# EAGLE design remote-displayV2 (EAGLE 9.6.2)
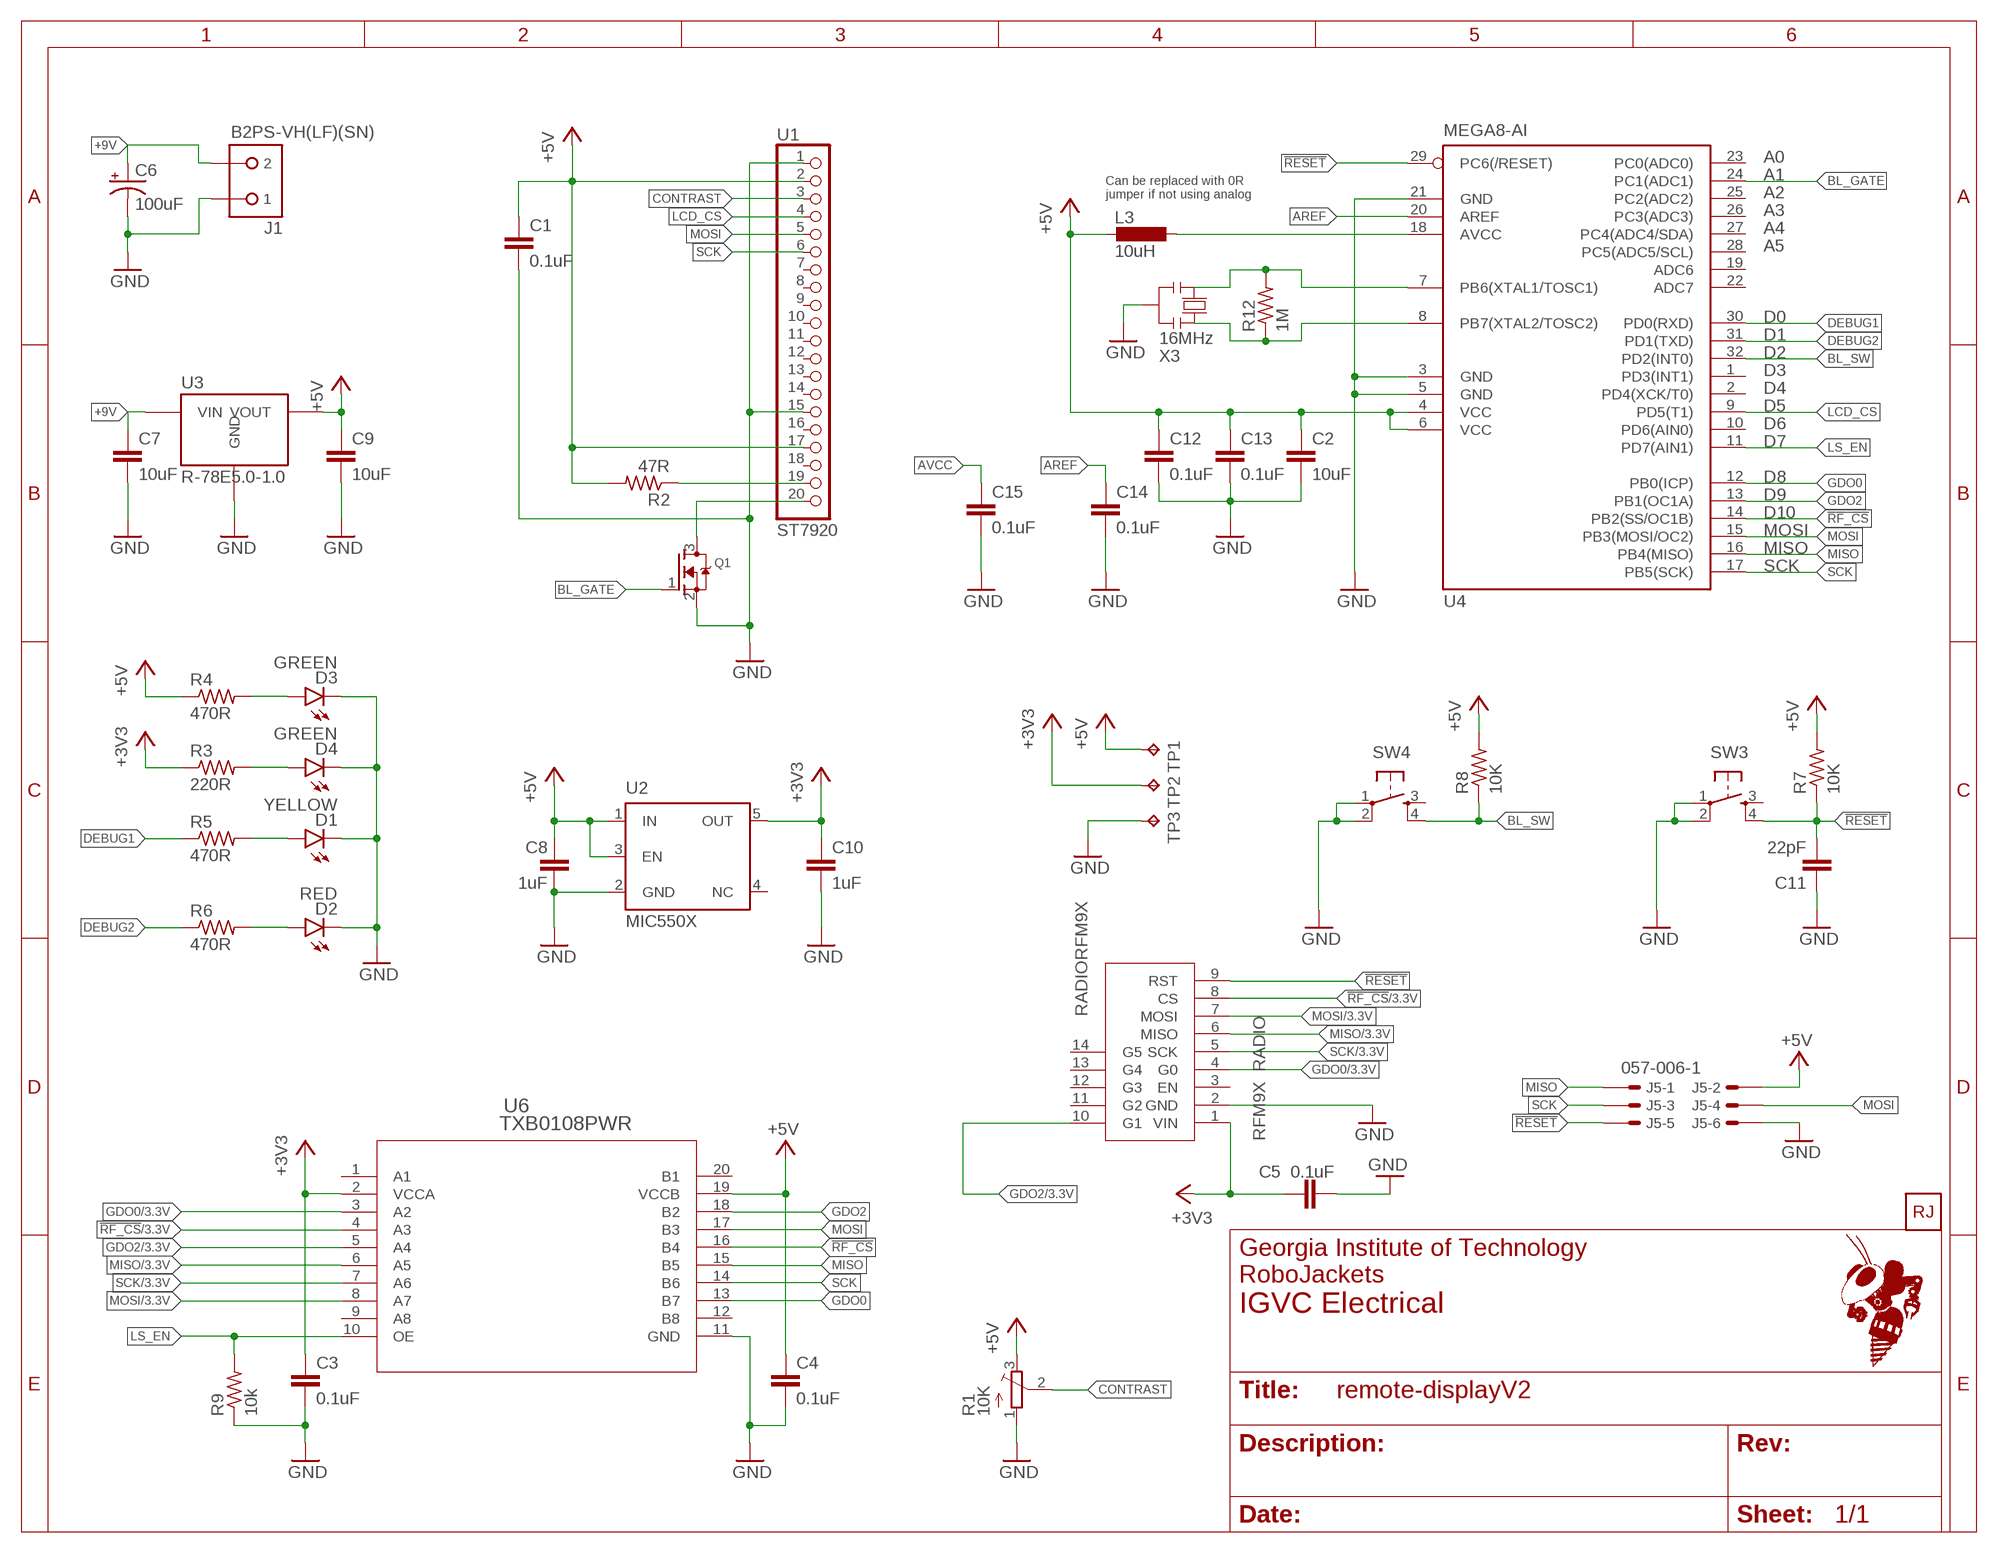
[diagram p0: schematic, sheet 1]
FRAME1 (FRAME_A_L): TEAM: IGVC Electrical

## Parts
C1  0.1uF  C-EUC0603  [C0603]
C2  10uF  C-EUC0805  [C0805]
C3  0.1uF  C-EUC0603  [C0603]
C4  0.1uF  C-EUC0603  [C0603]
C5  0.1uF  C-EUC0603  [C0603]
C6  100uF  CPOL-USE5-10.5  [E5-10,5]
C7  10uF  C-EUC0603  [C0603]
C8  1uF  C-EUC0603  [C0603]
C9  10uF  C-EUC0603  [C0603]
C10  1uF  C-EUC0603  [C0603]
C11  22pF  C-EUC0603  [C0603]
C12  0.1uF  C-EUC0603  [C0603]
C13  0.1uF  C-EUC0603  [C0603]
C14  0.1uF  C-EUC0603  [C0603]
C15  0.1uF  C-EUC0603  [C0603]
D1  YELLOW  LED3MM  [LED3MM]
D2  RED  LED3MM  [LED3MM]
D3  GREEN  LED3MM  [LED3MM]
D4  GREEN  LED3MM  [LED3MM]
J1  B2PS-VH(LF)(SN)  [B2PS-CENTERED]
J5  057-006-1  [057-006-1]
L3  10uH  L-0805  [0805]
Q1  MOSFET-NREFLOW  [SOT23]
R1  10K  TRIMPOT3386  [TRIM-3386]
R2  47R  R-US_R0805  [R0805]
R3  220R  R-US_R0603  [R0603]
R4  470R  R-US_R0603  [R0603]
R5  470R  R-US_R0603  [R0603]
R6  470R  R-US_R0603  [R0603]
R7  10K  R-US_R0603  [R0603]
R8  10K  R-US_R0603  [R0603]
R9  10k  R-US_R0603  [R0603]
R12  1M  R-US_R0603  [R0603]
SW3  TL1105_A-H  [TL1105_A-H]
SW4  TL1105_A-H  [TL1105_A-H]
TP1  TPPAD1-17  [P1-17]
TP2  TPPAD1-17  [P1-17]
TP3  TPPAD1-17  [P1-17]
U1  ST7920  [ST7920-LCD]
U2  MIC550X  [SOT23-DBV]
U3  R-78E5.0-1.0  [R-78E]
U4  MEGA8-AI  [TQFP32-08]
U6  TXB0108PWR  [PW20]
U$1  RADIORFM9X  [RFM9X]
U$2  ROBOBUZZ1.0X  [ROBOBUZZ_1.0X]
X3  16MHz  OSC_CSTCE16M0V53-R0  [RESONATOR]

## Nets
!RESET: C11.2 J5.5 R7.1 SW3.4 U4.29(PC6(/RESET)) U$1.9(RST)
!RF_CS!: U4.14(PB2(SS/OC1B)) U6.16(B4)
!RF_CS!/3.3V: U6.4(A3) U$1.8(CS)
+3V3: C3.1 C5.1 C10.1 R3.1 TP2.TP U2.5(OUT) U6.2(VCCA) U$1.1(VIN)
+5V [power]: C1.1 C2.1 C4.1 C8.1 C9.1 C12.1 C13.1 J5.2 L3.2 R1.3(E) R2.2 R4.1 R7.2 R8.2 TP1.TP U1.2 U1.17 U2.1(IN) U2.3(EN) U3.3(VOUT) U4.4(VCC) U4.6(VCC) U6.19(VCCB)
+9V [power]: C6.+ C7.1 J1.2 U3.1(VIN)
AREF: C14.1 U4.20(AREF)
AVCC: C15.1 L3.1 U4.18(AVCC)
BL_DRAIN: Q1.3(D) U1.20
BL_GATE: Q1.1(G) U4.24(PC1(ADC1))
BL_SW: R8.1 SW4.4 U4.32(PD2(INT0))
CONTRAST: R1.2(S) U1.3
DEBUG1: R5.1 U4.30(PD0(RXD))
DEBUG2: R6.1 U4.31(PD1(TXD))
GDO0: U4.12(PB0(ICP)) U6.13(B7)
GDO0/3.3V: U6.3(A2) U$1.4(G0)
GDO2: U4.13(PB1(OC1A)) U6.18(B2)
GDO2/3.3V: U6.5(A4) U$1.10(G1)
GND [power]: C1.2 C2.2 C3.2 C4.2 C5.2 C6.- C7.2 C8.2 C9.2 C10.2 C11.1 C12.2 C13.2 C14.2 C15.2 D1.K(C) D2.K(C) D3.K(C) D4.K(C) J1.1 J5.6 Q1.2(S) R1.1(A) R9.1 SW3.1 SW3.2 SW4.1 SW4.2 TP3.TP U1.1 U1.15 U2.2(GND) U3.2(GND) U4.3(GND) U4.5(GND) U4.21(GND) U6.11(GND) U$1.2(GND) X3.2
LCD_BL: R2.1 U1.19
LCD_CS: U1.4 U4.9(PD5(T1))
LS_EN: R9.2 U4.11(PD7(AIN1)) U6.10(OE)
MISO: J5.1 U4.16(PB4(MISO)) U6.15(B5)
MISO/3.3V: U6.6(A5) U$1.6(MISO)
MOSI: J5.4 U1.5 U4.15(PB3(MOSI/OC2)) U6.17(B3)
MOSI/3.3V: U6.8(A7) U$1.7(MOSI)
PWR_LED: D3.A R4.2
PWR_LED1: D4.A R3.2
SCK: J5.3 U1.6 U4.17(PB5(SCK)) U6.14(B6)
SCK/3.3V: U6.7(A6) U$1.5(SCK)
STAT1_LED: D1.A R5.2
STAT2_LED: D2.A R6.2
XTAL1: R12.2 U4.7(PB6(XTAL1/TOSC1)) X3.1
XTAL2: R12.1 U4.8(PB7(XTAL2/TOSC2)) X3.3
Unconnected: SW3.3 SW4.3 U1.7 U1.8 U1.9 U1.10 U1.11 U1.12 U1.13 U1.14 U1.16 U1.18 U2.4(NC) U4.1(PD3(INT1)) U4.2(PD4(XCK/T0)) U4.10(PD6(AIN0)) U4.19(ADC6) U4.22(ADC7) U4.23(PC0(ADC0)) U4.25(PC2(ADC2)) U4.26(PC3(ADC3)) U4.27(PC4(ADC4/SDA)) U4.28(PC5(ADC5/SCL)) U6.1(A1) U6.9(A8) U6.12(B8) U6.20(B1) U$1.3(EN) U$1.11(G2) U$1.12(G3) U$1.13(G4) U$1.14(G5)

## Notes on the sheet
- A0
- A1
- Can be replaced with 0R
  jumper if not using analog
- A2
- A3
- A4
- A5
- D0
- D1
- D2
- D3
- D4
- D5
- D6
- D7
- D8
- D9
- D10

## Library data of the parts
C1 C2 C5 C11-C15 = resistor:C-EU: CAPACITOR, European symbol
C3 C4 C7-C10 = rcl:C-EU: CAPACITOR, European symbol; SPICEPREFIX: C
C6 = rcl:CPOL-US: POLARIZED CAPACITOR, American symbol; SPICEPREFIX: C
D1-D4 = led:LED: LED OSRAM: - CHIPLED LG R971, LG N971, LY N971, LG Q971, LY Q971, LO R971, LY R971 LH N974, LH R974 LS Q976, LO Q976, LY Q976 LO Q996 - Hyper CHIPLED LW Q18S LB Q993, LB Q99A, LB R99A - SideLED LS A670, LO A670, LY A670, LG A670, LP A670 LB A673, LV A673, LT A673, LW A673 LH A674 LY A675 LS A676, LA A676, LO A676, LY A676, LW A676 LS A679, LY A679, LG A679 - Hyper Micro SIDELED® LS Y876, LA Y876, LO Y876, LY Y876 LT Y87S - SmartLED LW L88C, LW L88S LB L89C, LB L89S, LG L890 LS L89K, LO L89K, LY L89K LS L896, LA L896, LO L896, LY L896 - TOPLED LS T670, LO T670, LY T670, LG T670, LP T670 LSG T670, LSP T670, LSY T670, LOP T670, LYG T670 LG T671, LOG T671, LSG T671 LB T673, LV T673, LT T673, LW T673 LH T674 LS T676, LA T676, LO T676, LY T676, LB T676, LH T676, LSB T676, LW T676 LB T67C, LV T67C, LT T67C, LS T67K, LO T67K, LY T67K, LW E67C LS E67B, LA E67B, LO E67B, LY E67B, LB E67C, LV E67C, LT E67C LW T67C LS T679, LY T679, LG T679 LS T770, LO T770, LY T770, LG T770, LP T770 LB T773, LV T773, LT T773, LW T773 LH T774 LS E675, LA E675, LY E675, LS T675 LS T776, LA T776, LO T776, LY T776, LB T776 LHGB T686 LT T68C, LB T68C - Hyper Mini TOPLED® LB M676 - Mini TOPLED Santana® LG M470 LS M47K, LO M47K, LY M47K Source: http://www.osram.convergy.de LUXEON: - LUMILED® LXK2-PW12-R00, LXK2-PW12-S00, LXK2-PW14-U00, LXK2-PW14-V00 LXK2-PM12-R00, LXK2-PM12-S00, LXK2-PM14-U00 LXK2-PE12-Q00, LXK2-PE12-R00, LXK2-PE12-S00, LXK2-PE14-T00, LXK2-PE14-U00 LXK2-PB12-K00, LXK2-PB12-L00, LXK2-PB12-M00, LXK2-PB14-N00, LXK2-PB14-P00, LXK2-PB14-Q00 LXK2-PR12-L00, LXK2-PR12-M00, LXK2-PR14-Q00, LXK2-PR14-R00 LXK2-PD12-Q00, LXK2-PD12-R00, LXK2-PD12-S00 LXK2-PH12-R00, LXK2-PH12-S00 LXK2-PL12-P00, LXK2-PL12-Q00, LXK2-PL12-R00 Source: www.luxeon.com KINGBRIGHT: KA-3528ASYC Source: www.kingbright.com
J1 = RoboJackets-Connectors:B2P?-VH(LF)(SN): Power Connector Brand: JST Sales America Inc. <https://www.jst.com/> Series: VH <http://www.digikey.com/product-search/en?FV=fff40016,fff802f3,ffec0e9d> Distributor: Digi-Key <http://www.digikey.com/product-detail/en/B2PS-VH%28LF%29%28SN%29/455-1648-ND/926555>; DIGIKEY: 455-1648-ND; MPN: B2PS-VH(LF)(SN)
J5 = con-panduit:057-006-: CONNECTOR 6-pin series 057 contact pc board low profile headers; DIGIKEY: 3M15451-ND; OC_FARNELL: unknown; OC_NEWARK: unknown
L3 = IGVC-Remote:L
Q1 = adafruit:MOSFET-N: N-Channel Mosfet 2N7002E - 60V 260mA SOT23 [Digikey: 2N7002ET1GOSTR-ND] - REEL BSH103 - 30V 850mA SOT23 [Digikey: 568-5013-1-ND]
R1 = adafruit:TRIMPOT: SMT trimmer potentiometer part number TC33X http://www.ladyada.net/library/eagle
R2-R8 R12 = resistor:R-US_: RESISTOR, American symbol
R9 = rcl:R-US_: RESISTOR, American symbol; SPICEPREFIX: R
SW3 SW4 = IGVC-Switches:TL1105_A-H
TP1-TP3 = testpad:TP: Test pad
U1 = IGVC-Remote:ST7920
U2 = IGVC-Regulator:MIC550X
U3 = MotorBoardDev:R-78E5.0-1.0
U4 = atmel:MEGA8: MICROCONTROLLER 8 Kbytes FLASH, 1 kbytes SRAM, 512 bytes EEPROM, USART, 6-channel 10 bit ADC, 2-channel 8 bit ADC Pin compatible with Atmega48, ATMega88, ATMega168 Source: avr.lbr; MPN: ATMEGA8-16AU; OC_FARNELL: 9171371; OC_NEWARK: 73M8863
U6 = 296-21527-1-ND:TXB0108PWR; MANUFACTURER_PART_NUMBER: TXB0108PWR; VENDOR: Texas Instruments
U$1 = RADIO library:RADIO
U$2 = RoboJackets-Aesthetics:ROBOBUZZ
X3 = IGVC-Remote:OSC_CSTCE16M0V53-R0: 16Mhz - SMD; MONTHLY_USAGE: _____; PART_NUMBER: CSTCE16M0V53-R0; PRICE: _____; SUPPLIER: _____; TYPE: Cristalli; VALUE: CSTCE16M0V53-R0

## Net classes
1 power: width 0.3 mm

## Board
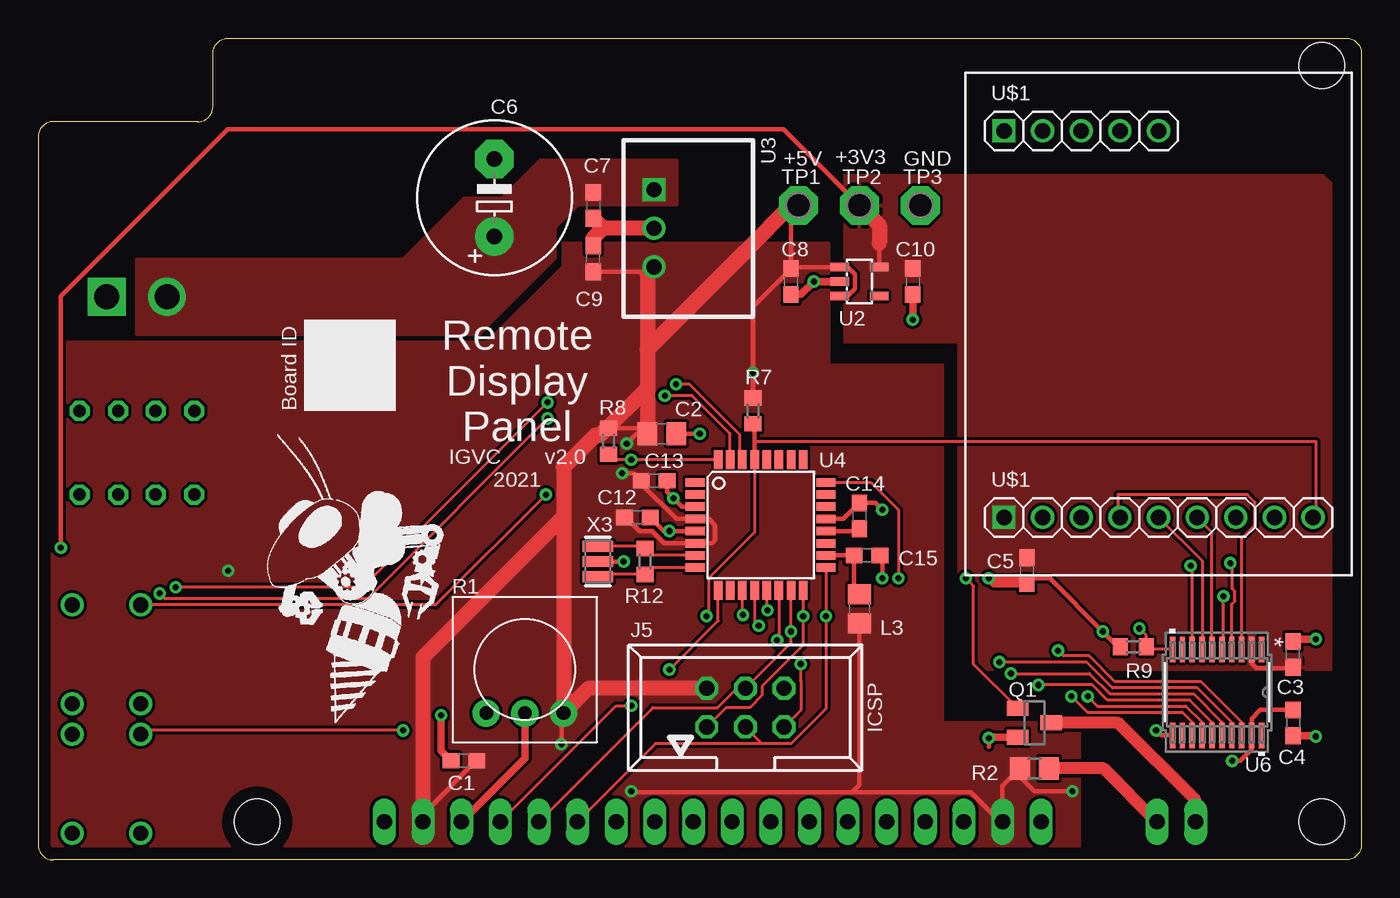
[diagram p1: board, top side]
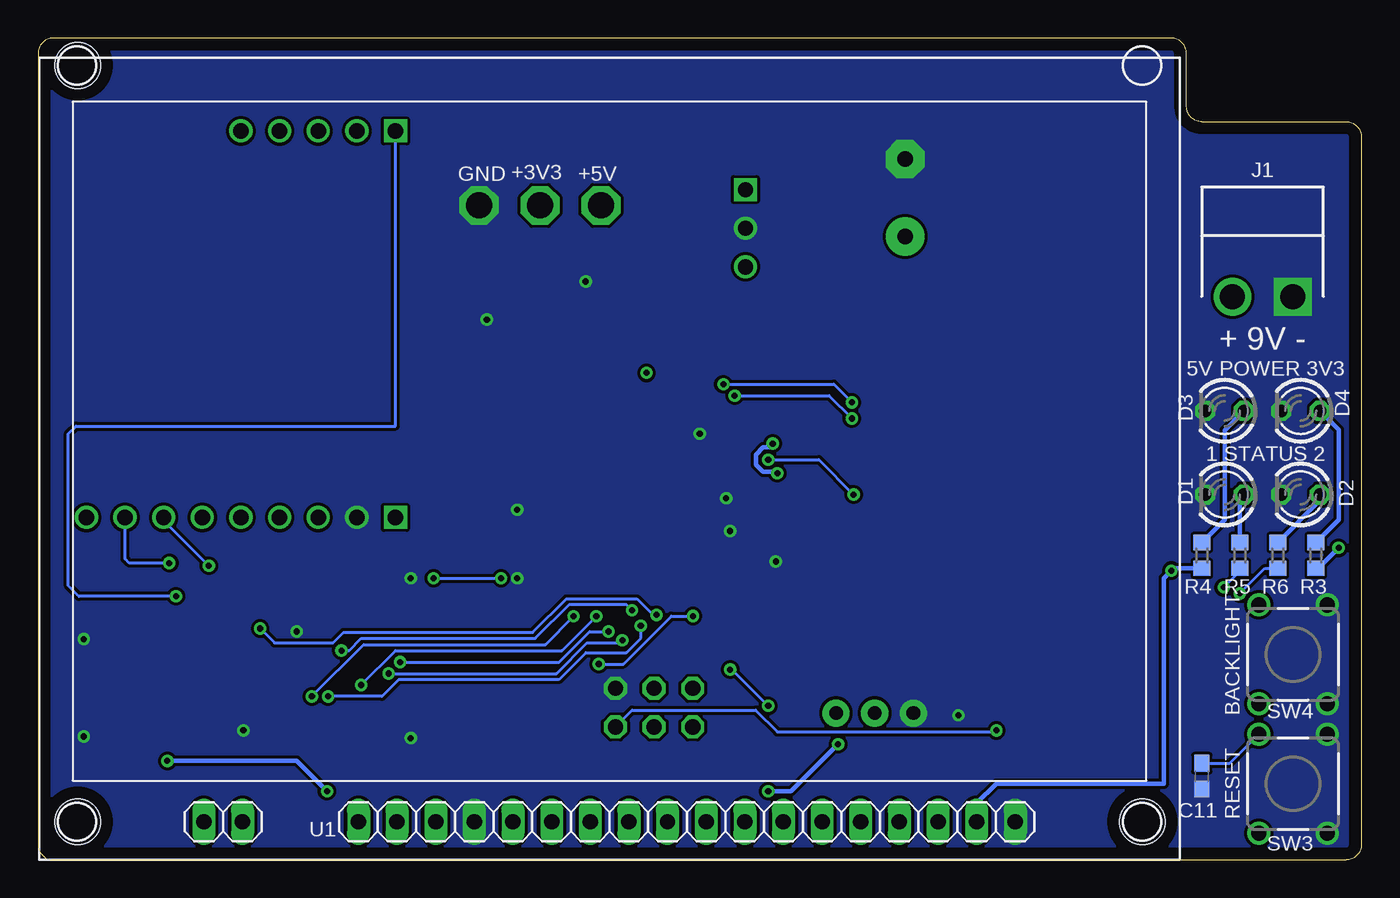
[diagram p2: board, bottom side, seen from below]

Size 87 x 54 mm. Coordinates in mm from the lower left corner, seen from the top.
Outline: 10.5,48.5 1,48.5 arc90 0,47.5 0,1 arc90 1,0 86,0 arc90 87,1 87,53 arc90 86,54 12.5,54 arc90 11.5,53 11.5,49.5 arc-90 10.5,48.5
Copper layers (1*16): Top 0.035mm / dielectric 1.5mm / Bottom 0.035mm
Design rules "default *": minimum track width 0.2mm, minimum drill 0.4mm, track to track 0.2mm, track to pad 0.25mm, pad to pad 0.2mm, via to via 0.25mm, smd to smd 0.2mm, copper to edge 0.8mm, drill to drill 0.2mm, minimum pad ring 10mil, minimum via ring 8mil, stop-mask expansion 4mil, vias tented up to drill 16mil, thermal gap 10mil
Holes 3 mm at 14.9,69.2 84.4,52.2 84.4,2.5 14.4,2.5
tKeepout: area 0,0 to 26,48.8

### Footprints (pad centres in the part's own frame; a part is rotated, then mirrored left to right if it is on the bottom)
C0603 = smd 1.1 x 1: 1 -0.85,0; 2 0.85,0
C0805 = smd 1.3 x 1.5: 1 -0.95,0; 2 0.95,0
E5-10,5 = drill 1.016 pad 2.54: + -2.54,0 | drill 1.016 pad 2.54 octagon: - 2.54,0
LED3MM = drill 0.813 octagon: A -1.27,0; K 1.27,0
B2PS-CENTERED = drill 1.65 square: 1 -1.98,0 | drill 1.65: 2 1.98,0
057-006-1 = drill 1 octagon: 1 -2.54,-1.27; 2 -2.54,1.27; 3 0,-1.27; 4 0,1.27; 5 2.54,-1.27; 6 2.54,1.27
0805 = smd 1.3 x 1.5: 1 -0.95,0; 2 0.95,0
SOT23 = smd 1 x 1.4: 1 -0.95,-1.1; 2 0.95,-1.1; 3 0,1.1
TRIM-3386 = drill 0.9 pad 1.778: 1 -2.54,-2.857; 2 0,-2.857; 3 2.54,-2.857
R0805 = smd 1.3 x 1.5: 1 -0.95,0; 2 0.95,0
R0603 = smd 1 x 1.1: 1 -0.85,0; 2 0.85,0
TL1105_A-H = drill 1: 1 -2.25,3.25; 2 -2.25,-3.25; 3 2.25,3.25; 4 2.25,-3.25
P1-17 = drill 1.702 pad 2.54 octagon: TP 0,0
ST7920-LCD = drill 1.016 long: 1 64.17,2.5; 2 61.63,2.5; 3 59.09,2.5; 4 56.55,2.5; 5 54.01,2.5; 6 51.47,2.5; 7 48.93,2.5; 8 46.39,2.5; 9 43.85,2.5; 10 41.31,2.5; 11 38.77,2.5; 12 36.23,2.5; 13 33.69,2.5; 14 31.15,2.5; 15 28.61,2.5; 16 26.07,2.5; 17 23.53,2.5; 18 20.99,2.5; 19 13.37,2.5; 20 10.83,2.5
SOT23-DBV = smd 0.55 x 1.2: 1 -0.95,-1.3; 2 0,-1.3; 3 0.95,-1.3; 4 0.95,1.3; 5 -0.95,1.3
R-78E = drill 1 square: 1 -2.54,0 | drill 1: 2 0,0; 3 2.54,0
TQFP32-08 = smd 1.27 x 0.559: 1 -4.293,2.8; 2 -4.293,2; 3 -4.293,1.2; 4 -4.293,0.4; 5 -4.293,-0.4; 6 -4.293,-1.2; 7 -4.293,-2; 8 -4.293,-2.8; 17 4.293,-2.8; 18 4.293,-2; 19 4.293,-1.2; 20 4.293,-0.4; 21 4.293,0.4; 22 4.293,1.2; 23 4.293,2; 24 4.293,2.8 | smd 0.559 x 1.27: 9 -2.8,-4.293; 10 -2,-4.293; 11 -1.2,-4.293; 12 -0.4,-4.293; 13 0.4,-4.293; 14 1.2,-4.293; 15 2,-4.293; 16 2.8,-4.293; 25 2.8,4.293; 26 2,4.293; 27 1.2,4.293; 28 0.4,4.293; 29 -0.4,4.293; 30 -1.2,4.293; 31 -2,4.293; 32 -2.8,4.293
PW20 = smd 1.676 x 0.356: 1 -2.819,2.925; 2 -2.819,2.275; 3 -2.819,1.625; 4 -2.819,0.975; 5 -2.819,0.325; 6 -2.819,-0.325; 7 -2.819,-0.975; 8 -2.819,-1.625; 9 -2.819,-2.275; 10 -2.819,-2.925; 11 2.819,-2.925; 12 2.819,-2.275; 13 2.819,-1.625; 14 2.819,-0.975; 15 2.819,-0.325; 16 2.819,0.325; 17 2.819,0.975; 18 2.819,1.625; 19 2.819,2.275; 20 2.819,2.925
RFM9X = drill 1.016 square: 1 0,0; 10 0,25.4 | drill 1.016: 2 2.54,0; 3 5.08,0; 4 7.62,0; 5 10.16,0; 6 12.7,0; 7 15.24,0; 8 17.78,0; 9 20.32,0; 11 2.54,25.4; 12 5.08,25.4; 13 7.62,25.4; 14 10.16,25.4
RESONATOR = smd 0.7 x 2: 1 -1,0; 2 0,0; 3 1,0

### Placement (x,y rotation side)
C1  28,6.5 180 top
C2  41,28 0 top
C3  82.5,13.5 90 top
C4  82.5,9 270 top
C5  65,19 270 top
C6  30,43.5 90 top
C7  36.5,43 270 top
C8  49.5,38 270 top
C9  36.5,39.5 90 top
C10  57.5,38 270 top
C11  10.5,5.5 90 bottom
C12  39.4,22.5 0 top
C13  40.5,24.9 0 top
C14  54,22.6 90 top
C15  54.5,20 0 top
D1  9,24 180 bottom
D2  4,24 180 bottom
D3  9,29.5 180 bottom
D4  4,29.5 180 bottom
J1  6.5,37 180 bottom
J5  46.5,10 0 top
L3  54,16.5 270 top
Q1  65.5,9 270 top
R1  32,12.5 0 top
R2  65.5,6 180 top
R3  3,20 90 bottom
R4  10.5,20 90 bottom
R5  8,20 90 bottom
R6  5.5,20 90 bottom
R7  47,29.5 90 top
R8  37.5,27.5 90 top
R9  72,14 0 top
R12  39.9,19.6 90 top
SW3  4.5,5 180 bottom
SW4  4.5,13.5 180 bottom
TP1  50,43 0 top
TP2  54,43 0 top
TP3  58,43 0 top
U1  86.93,0 0 bottom
U2  54,38 270 top
U3  40.5,41.5 270 top
U4  47.5,22 0 top
U6  77.5,11 270 top
U$1  63.5,22.5 0 top
U$2  19.5,9 0 top
X3  36.8,19.6 270 top

### Tracks (layer width: path | path; a pad name or v marks a point on that pad's centre or on a via)
!RESET  (via drill 0.4)
  Top 0.2: U4.29 47.1,21.52 44.07,18.49 44.07,16.14 v43.95,16.01 | v50.14,12.86 50.14,11.73 50.14,9.83 J5.5 | SW3.4 7,8.5 v24,8.5 | 47.1,27.5 84,27.5 84,22.68 U$1.9
  Top 0.3: U4.29 47.1,27.5 47.1,28.55 R7.1
  Bottom 0.2: C11.2 8.65,6.35 SW3.4 | v43.95,16.01 45.36,16.01 48.51,12.86 v50.14,12.86 | J5.5 47.94,9.83 39.83,9.83 38.4,8.4 24.1,8.4 v24,8.5
!RF_CS!  (via drill 0.4)
  Top 0.2: U4.14 48.7,14.54 v48.59,14.42 | U6.16 77.83,9.04 75.97,10.9 70.46,10.9 69.12,12.24 v63.95,12.24
  Bottom 0.2: v48.59,14.42 48.76,14.25 50.92,14.25 52.93,12.24 v63.95,12.24
!RF_CS!/3.3V  (via drill 0.4)
  Top 0.2: U6.4 78.47,16.8 78.68,17 78.68,17.62 78.5,17.81 78.5,19.5 v78.37,19.5
  Bottom 0.2: v78.37,19.5 81,19.5 81.28,19.78 U$1.8
+3V3  (via drill 0.4)
  Top 0.3: U2.5 55.3,40.5 55.3,40.7 | v1.5,20.5 1.5,37.02 12.48,48 49,48 TP2.TP | C3.1 82.43,12.58 80.08,12.58 79.78,12.89 U6.2
  Top 1: TP2.TP 55.3,41.7 55.3,40.5
  Bottom 0.3: v1.5,20.5 2.85,19.15 R3.1
  pour Top (no thermals): 83,40.5 83,12.8 62,12.8 62,35 54.5,35 54.5,40.5
  pour Top: 85,12.5 60.5,12.5 60.5,34 53,34 53,45 84.5,45 85,44.5
+5V  (via drill 0.4)
  Top 0.3: C12.1 38.63,22.5 39.53,21.6 40.37,21.6 41.17,20.8 U4.6 44.3,20.8 44.5,21 44.5,22 44.1,22.4 U4.4 41.97,22.4 39.65,24.72 C13.1 | v78.5,6.5 79.03,6.5 79.78,7.25 U6.19 79.78,9.28 80.35,9.85 C4.1 | L3.2 54,4.92 53.5,4.42 | 53.5,4.42 61.34,4.42 63.27,2.5 U1.17 63.4,4.85 64.28,5.72 | 64.28,5.72 R2.2 | v68,4.5 65.5,4.5 64.28,5.72 | 53.5,4.42 39.08,4.42 v39,4.5 | v34.41,7.59 34.41,9.51 R1.3 | C9.1 40.19,38.65 U3.3 | C8.1 49.5,42.5 TP1.TP | C8.1 49.6,38.95 U2.1 53.24,38.95 53.7,38.49 53.7,37.51 53.24,37.05 U2.3 | U1.2 25.3,3.26 25.56,3.26 28.8,6.5 C1.1 | R8.2 39.7,28.35 C2.1 39.35,28 v38.7,27.35 | C13.1 39.65,25.15 | R7.2 v47,32 47,36.35 C8.1 | C13.1 39.15,25.4 v38.4,25.4
  Top 1: J5.2 36.17,11.27 R1.3 34.54,22.54 | U3.3 40.05,38.51 40.05,33.55 40.05,31 | 40.05,31 C2.1 | 40.05,31 36.95,27.9 36.64,27.9 34.54,25.8 34.54,22.54 | U1.2 25.3,13.3 34.54,22.54 | TP1.TP 49.5,43 46.5,40
  Top 1.016: 46.5,40 40.05,33.55
  Bottom 0.3: R4.1 12.35,19.15 v12.5,19 13,18.5 13,5 24,5 25.3,3.7 U1.2 | v78.5,6.5 70,6.5 v68,4.5 | v39,4.5 37.5,4.5 v34.41,7.59 | v38.4,25.4 38.49,25.49 39.33,25.49 39.8,25.96 39.8,26.62 39.33,27.1 38.96,27.1 v38.7,27.35
  pour Top (no thermals): 68.5,0 68.5,9 59.5,9 59.5,32.5 52,32.5 52,40.5 34.5,40.5 34.5,39 29.5,34 1.5,34 0,32.5 0,0
+9V
  pour Top (no thermals): 6.5,34.5 6.5,39.5 24,39.5 28,43.5 30.5,43.5 33,46 42,46 42,43 35.5,43 34,41.5 34,39.5 29,34.5
AREF
  Top 0.3: C14.1 53.85,21.6 U4.20
AVCC
  Top 0.3: U4.18 C15.1 53.65,17.8 L3.1
BL_DRAIN
  Top 0.8: U1.20 76.1,3.9 71,9 Q1.3
BL_GATE  (via drill 0.4)
  Top 0.2: Q1.1 61.5,12.85 61.5,18 v61,18.5 | v56.56,18.5 56.56,23.01 54.77,24.8 U4.24
  Bottom 0.2: v61,18.5 v56.56,18.5
BL_SW  (via drill 0.4)
  Top 0.2: U4.32 v39,26.29 37.86,26.29 R8.1 | v33.39,24 26.14,16.75 SW4.4
  Bottom 0.2: v39,26.29 35.68,26.29 v33.39,24
CONTRAST
  Top 0.5: R1.2 32,6.67 U1.3
DEBUG1  (via drill 0.4)
  Top 0.2: U4.30 46.13,26.46 46.13,27.94 42.81,31.25 v41.94,31.25 | v33.49,30.06 21.34,17.9 v9.06,17.9
  Bottom 0.2: v41.94,31.25 34.69,31.25 v33.49,30.06 | v9.06,17.9 8,18.96 R5.1
DEBUG2  (via drill 0.4)
  Top 0.2: U4.31 45.5,28 43,30.5 v41.2,30.5 | v33.5,29 21.65,17.15 8.35,17.15 v8,17.5
  Bottom 0.2: v41.2,30.5 35,30.5 v33.5,29 | v8,17.5 6.35,19.15 R6.1
GDO0  (via drill 0.4)
  Top 0.2: U4.12 47.1,15.65 v47.38,15.38 | U6.13 75.88,9.04 75.22,9.7 68.97,9.7 v67.94,10.73
  Bottom 0.2: v47.38,15.38 47.38,14.56 48.33,13.62 50.99,13.62 52.76,11.84 63.28,11.84 64.39,10.73 v67.94,10.73
GDO0/3.3V
  Top 0.2: U6.3 79.12,17 79.12,17.11 79.12,21.12 80,22 80,23.5 79.5,24 71,24 71,22.62 U$1.4
GDO2  (via drill 0.4)
  Top 0.2: U4.13 47.9,16.45 v47.95,16.4 | U6.18 79.12,9.04 76.47,11.7 70.8,11.7 69.1,13.39 67.41,13.39 v67.05,13.75
  Bottom 0.2: v67.05,13.75 66.55,13.75 65.75,14.55 54.31,14.55 52.1,16.75 48.3,16.75 v47.95,16.4
GDO2/3.3V  (via drill 0.4)
  Top 0.2: U6.5 77.93,13.92 v77.93,17.31
  Bottom 0.2: v77.93,17.31 84.31,17.31 85,18 85,28 84.5,28.5 63.5,28.5 U$1.10
GND  (via drill 0.4)
  Top 0.3: U4.5 v41.5,21.6 | v41.5,21.6 41.15,21.6 C12.2 | U4.3 42.33,23.2 v41.76,23.76 41.35,24.18 C13.2 | v41.5,21.6 | C15.2 55.5,19.85 v55.5,18.5 | U4.21 52.95,22.4 C14.2 55.05,23.45 v55.5,23 | C2.2 v43.5,28 | X3.2 v38.5,19.6 | U6.11 73.82,8.18 v73.5,8.5 | R9.1 71,14 v70,15 66.5,18.5 v62.5,18.5 | v62.5,8 62.5,7.44 | 58.32,3.26 U1.15
  Top 0.5: C1.2 26.5,7.15 v26.5,9.5 | C5.2 62.85,18.15 v62.5,18.5 | Q1.2 62.55,8.05 v62.5,8 | C10.2 v57.5,35.5 | U2.2 v51,38 50.15,37.15 C8.2 | C3.2 82.65,14.5 v84,14.5 | C4.2 83.95,8.15 v84,8.1
  Top 1: U3.2 37.15,41.5 | 37.15,41.5 C7.2 | C9.2 36.5,40.85 37.15,41.5
  pour Bottom (no thermals): -1,55 88,55 88,-1 -1,-1
LCD_BL
  Top 0.8: U1.19 70.06,6 R2.1
LCD_CS  (via drill 0.4)
  Top 0.2: U1.4 38,10.12 v39,10.12 | v41.5,12.5 44.7,15.7 U4.9
  Bottom 0.2: v39,10.12 41.38,12.5 v41.5,12.5
LS_EN  (via drill 0.4)
  Top 0.2: U6.10 73.03,13.82 R9.2 72.85,14.75 v72.4,15.2 | v46.35,16.09 46.3,16.14 U4.11
  Bottom 0.2: v72.4,15.2 71.45,14.25 67.62,14.25 66.92,14.95 54.48,14.95 52.27,17.15 47.63,17.15 46.58,16.09 v46.35,16.09
MISO  (via drill 0.4)
  Top 0.2: J5.1 45.23,10 46.79,10 47.6,10.81 47.6,11.39 50.3,14.09 v50.3,16 U4.16 | U6.15 77.17,9.04 75.72,10.5 70.3,10.5 69.31,11.49 v65.77,11.49
  Bottom 0.2: v65.77,11.49 63.51,13.75 52.55,13.75 v50.3,16
MISO/3.3V
  Top 0.2: U$1.6 77.17,21.52 U6.6
MOSI  (via drill 0.4)
  Top 0.2: U4.15 v49.5,15 49.5,14.27 J5.4 45.93,11.27 44.66,10 40.42,10 U1.5 | U6.17 78.47,9.04 78.01,9.51 76.22,11.3 70.63,11.3 68.94,12.99 v63.2,12.99
  Bottom 0.2: v49.5,15 50.73,15 52.74,12.99 v63.2,12.99
MOSI/3.3V  (via drill 0.4)
  Top 0.2: 75.88,14.68 U6.8 75.88,19.22 v75.77,19.32
  Bottom 0.2: v75.77,19.32 78.74,22.29 U$1.7
PWR_LED
  Bottom 0.3: R4.2 9,22.35 9,28.23 D3.A
PWR_LED1
  Bottom 0.3: R3.2 1.5,22.35 1.5,28.27 D4.A
SCK  (via drill 0.4)
  Top 0.2: U4.17 v51.79,16 51.79,9.92 49.5,7.63 47.6,7.63 | 47.6,7.63 J5.3 | 47.6,7.63 40.59,7.63 U1.6 | U6.14 76.53,9.04 75.47,10.1 69.63,10.1 v69,10.73
  Bottom 0.2: v51.79,16 53.65,14.15 65.59,14.15 v69,10.73
SCK/3.3V
  Top 0.2: U6.7 76.53,14.68 76.53,19.64 U$1.5 73.57,22.41
STAT1_LED
  Bottom 0.3: R5.2 8,23.73 D1.A
STAT2_LED
  Bottom 0.3: R6.2 2.73,23.62 D2.A
XTAL1
  Top 0.2: U4.7 40.35,20 R12.2 39.75,20.6 X3.1
XTAL2
  Top 0.2: U4.8 40.35,19.2 R12.1 36.95,18.75 X3.3

### Text on the board
tPlace: +5V | +3V3 | GND | Board ID | Remote / Display / Panel | IGVC | v2.0 | 2021 | ICSP
bPlace: +5V | +3V3 | GND | + 9V - | 5V POWER 3V3 | 1 STATUS 2 | BACKLIGHT | RESET